# Altium schematic sheet ngh-main.SchDoc
size A4
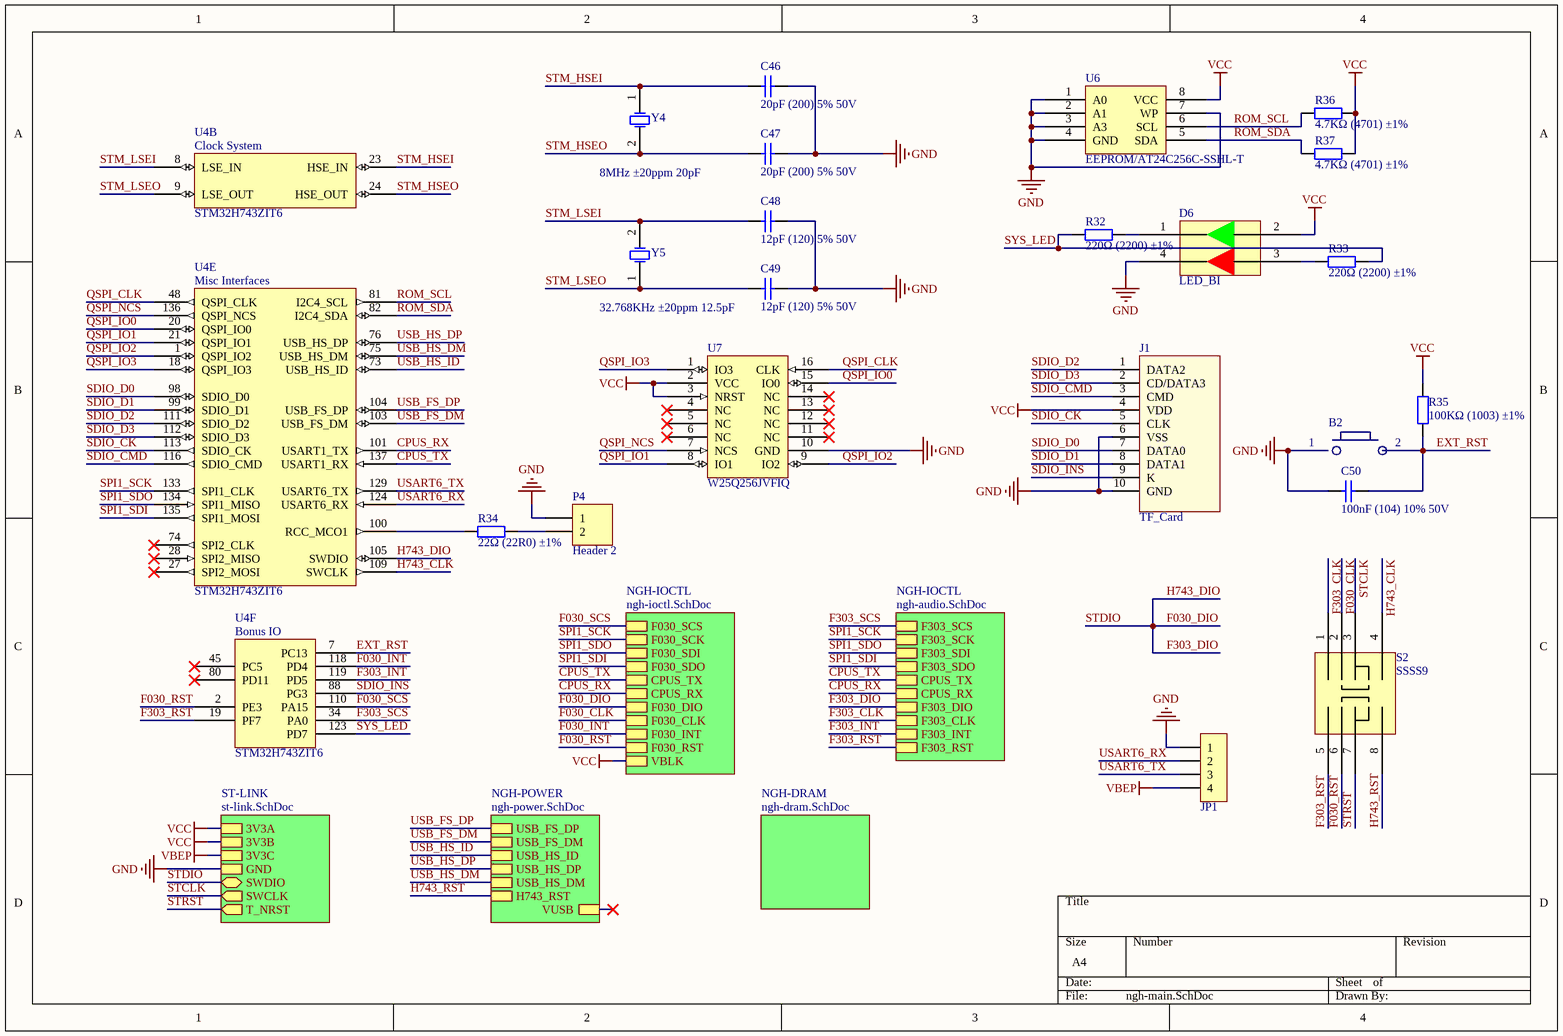
[diagram p0: ngh-main.SchDoc]

## Parts
B2  B1  [MetalButton]  (value not drawn)
C46  20pF (200) 5% 50V  [0603_C]
C47  20pF (200) 5% 50V  [0603_C]
C48  12pF (120) 5% 50V  [0603_C]
C49  12pF (120) 5% 50V  [0603_C]
C50  100nF (104) 10% 50V  [0603_C]
D6  LED_BI  [LED_BI]
J1  TF_Card  [Micro SD]
JP1  HDR-1X4  [HDR2.54-WS-4P]  (value not drawn)
P4  Header 2  [HDR1X2]
R32  220Ω (2200) ±1%  [0603_R]
R33  220Ω (2200) ±1%  [0603_R]
R34  22Ω (22R0) ±1%  [0603_R]
R35  100KΩ (1003) ±1%  [0603_R]
R36  4.7KΩ (4701) ±1%  [0603_R]
R37  4.7KΩ (4701) ±1%  [0603_R]
S2  SSSS9  [SSSS9_5mm_H]
U4  STM32H743ZIT6  [LQFP-144_20x20]  (parts B,E,F of 6)
U6  EEPROM/AT24C256C-SSHL-T  [SOIC-8_150mil]
U7  W25Q256JVFIQ  [SOIC-16_300mil]
Y4  8MHz ±20ppm 20pF  [SMD-5032_2P]
Y5  32.768KHz ±20ppm 12.5pF  [SMD-3215_2P FC - 135]

## Sub-sheets
NGH-DRAM = ngh-dram.SchDoc: no entries
NGH-IOCTL = ngh-ioctl.SchDoc: F030_SCS, F030_SCK, F030_SDI, F030_SDO, CPUS_TX, CPUS_RX, F030_DIO, F030_CLK, F030_INT, F030_RST, VBLK
NGH-IOCTL = ngh-audio.SchDoc: F303_SCS, F303_SCK, F303_SDI, F303_SDO, CPUS_TX, CPUS_RX, F303_DIO, F303_CLK, F303_INT, F303_RST
NGH-POWER = ngh-power.SchDoc: USB_FS_DP, USB_FS_DM, USB_HS_ID, USB_HS_DP, USB_HS_DM, H743_RST, VUSB
ST-LINK = st-link.SchDoc: 3V3A, 3V3B, 3V3C, GND, SWDIO (bidir), SWCLK (out), T_NRST (out)

## Nets
GND: B2.1 C46.2 C47.2 C48.2 C49.2 C50.1 D6.4 J1.6(VSS) J1.10(GND) JP1.1 P4.1 U6.1(A0) U6.2(A1) U6.3(A3) U6.4(GND) U6.7(WP) U7.10(GND) ; sheet ST-LINK/GND
VBEP: JP1.4 ; sheet ST-LINK/3V3C
VCC: D6.2 J1.4(VDD) R35.2 R36.1 R37.1 U6.8(VCC) U7.2(VCC) U7.3(NRST) ; sheet ST-LINK/3V3A, sheet ST-LINK/3V3B, sheet NGH-IOCTL/VBLK
CPUS_RX: U4.101(USART1_TX) ; sheet NGH-IOCTL/CPUS_RX, sheet NGH-IOCTL/CPUS_RX
CPUS_TX: U4.137(USART1_RX) ; sheet NGH-IOCTL/CPUS_TX, sheet NGH-IOCTL/CPUS_TX
EXT_RST: B2.2 C50.2 R35.1 U4.7(PC13)
F030_CLK: S2.2 ; sheet NGH-IOCTL/F030_CLK
F030_DIO: U4.105(SWDIO) ; sheet ST-LINK/SWDIO, sheet NGH-IOCTL/F030_DIO, sheet NGH-IOCTL/F303_DIO  [also labelled F303_DIO, H743_DIO, STDIO]
F030_INT: U4.118(PD4) ; sheet NGH-IOCTL/F030_INT
F030_RST: S2.6 U4.2(PE3) ; sheet NGH-IOCTL/F030_RST
F030_SCS: U4.110(PA15) ; sheet NGH-IOCTL/F030_SCS
F303_CLK: S2.1 ; sheet NGH-IOCTL/F303_CLK
F303_INT: U4.119(PD5) ; sheet NGH-IOCTL/F303_INT
F303_RST: S2.5 U4.19(PF7) ; sheet NGH-IOCTL/F303_RST
F303_SCS: U4.34(PA0) ; sheet NGH-IOCTL/F303_SCS
H743_CLK: S2.4 U4.109(SWCLK)
H743_RST: S2.8 ; sheet NGH-POWER/H743_RST
QSPI_CLK: U4.48(QSPI_CLK) U7.16(CLK)
QSPI_IO0: U4.20(QSPI_IO0) U7.15(IO0)
QSPI_IO1: U4.21(QSPI_IO1) U7.8(IO1)
QSPI_IO2: U4.1(QSPI_IO2) U7.9(IO2)
QSPI_IO3: U4.18(QSPI_IO3) U7.1(IO3)
QSPI_NCS: U4.136(QSPI_NCS) U7.7(NCS)
ROM_SCL: R36.2 U4.81(I2C4_SCL) U6.6(SCL)
ROM_SDA: R37.2 U4.82(I2C4_SDA) U6.5(SDA)
SDIO_CK: J1.5(CLK) U4.113(SDIO_CK)
SDIO_CMD: J1.3(CMD) U4.116(SDIO_CMD)
SDIO_D0: J1.7(DATA0) U4.98(SDIO_D0)
SDIO_D1: J1.8(DATA1) U4.99(SDIO_D1)
SDIO_D2: J1.1(DATA2) U4.111(SDIO_D2)
SDIO_D3: J1.2(CD/DATA3) U4.112(SDIO_D3)
SDIO_INS: J1.9(K) U4.88(PG3)
SPI1_SCK: U4.133(SPI1_CLK) ; sheet NGH-IOCTL/F030_SCK, sheet NGH-IOCTL/F303_SCK
SPI1_SDI: U4.135(SPI1_MOSI) ; sheet NGH-IOCTL/F030_SDO, sheet NGH-IOCTL/F303_SDO
SPI1_SDO: U4.134(SPI1_MISO) ; sheet NGH-IOCTL/F030_SDI, sheet NGH-IOCTL/F303_SDI
STCLK: S2.3 ; sheet ST-LINK/SWCLK
STM_HSEI: C46.1 U4.23(HSE_IN) Y4.1(OSC1)
STM_HSEO: C47.1 U4.24(HSE_OUT) Y4.2(OSC2)
STM_LSEI: C48.1 U4.8(LSE_IN) Y5.2(OSC2)
STM_LSEO: C49.1 U4.9(LSE_OUT) Y5.1(OSC1)
STRST: S2.7 ; sheet ST-LINK/T_NRST
SYS_LED: R32.1 R33.2 U4.123(PD7)
USART6_RX: JP1.2 U4.124(USART6_RX)
USART6_TX: JP1.3 U4.129(USART6_TX)
USB_FS_DM: U4.103(USB_FS_DM) ; sheet NGH-POWER/USB_FS_DM
USB_FS_DP: U4.104(USB_FS_DP) ; sheet NGH-POWER/USB_FS_DP
USB_HS_DM: U4.75(USB_HS_DM) ; sheet NGH-POWER/USB_HS_DM
USB_HS_DP: U4.76(USB_HS_DP) ; sheet NGH-POWER/USB_HS_DP
USB_HS_ID: U4.73(USB_HS_ID) ; sheet NGH-POWER/USB_HS_ID
NetD6_1: D6.1 R32.2
NetD6_3: D6.3 R33.1
NetP4_2: P4.2 R34.2
NetR34_1: R34.1 U4.100(RCC_MCO1)

Not connected (* = marked no-connect by the designer): U4 27(SPI2_MOSI)* 28(SPI2_MISO)* 45(PC5)* 74(SPI2_CLK)* 80(PD11)*; U7 4(NC)* 5(NC)* 6(NC)* 11(NC)* 12(NC)* 13(NC)* 14(NC)*

## Notes on the sheet
- (in symbol STM32H743ZIT6, part B) Clock System
- (in symbol STM32H743ZIT6, part E) Misc Interfaces
- (in symbol STM32H743ZIT6, part F) Bonus IO

## Library data of the parts
B2 = MetalButton
C46 C47 = 0603 20pF (200) 5% 50V: 贴片电容; ComponentLink1Description: 供应商链接; ComponentLink1URL: http://www.szlcsc.com/product/details_2000.html; Package: 0603; Supplier: LC; SuppliersPartNumber: C1648
C48 C49 = 0603 12pF (120) 5% 50V: 贴片电容; ComponentLink1Description: 供应商链接; ComponentLink1URL: http://www.szlcsc.com/product/details_39506.html; Package: 0603; Supplier: LC; SuppliersPartNumber: C38523
C50 = 0603 100nF (104) 10% 50V: 贴片电容; ComponentLink1Description: 供应商链接; ComponentLink1URL: http://www.szlcsc.com/product/details_15331.html; Package: 0603; Supplier: LC; SuppliersPartNumber: C14663
J1 = TF_Card: TF卡座; 版权归属: 源创客; BOM名称: TF卡座; 学习资源: www.ooocke.com
JP1 = Header 4: 4P接插件; 版权归属: 源创客; BOM名称: 4P接插件; 学习资源: www.ooocke.com
P4 = Header 2: Header, 2-Pin; LatestRevisionDate: 17-Jul-2002; LatestRevisionNote: Re-released for DXP Platform.; Publisher: Altium Limited
R32 R33 = 0603 220Ω (2200) 1%: 贴片电阻; ComponentLink1Description: 供应商链接; ComponentLink1URL: http://www.szlcsc.com/product/details_23689.html; Package: 0603; Supplier: LC; SuppliersPartNumber: C22962
R34 = 0603 22Ω (22R0) 1%: 贴片电阻; ComponentLink1Description: 供应商链接; ComponentLink1URL: http://www.szlcsc.com/product/details_24078.html; Package: 0603; Supplier: LC; SuppliersPartNumber: C23345
R35 = 0603 100KΩ (1003) 1%: 贴片电阻; ComponentLink1Description: 供应商链接; ComponentLink1URL: http://www.szlcsc.com/product/details_26546.html; Package: 0603; Supplier: LC; SuppliersPartNumber: C25803
R36 R37 = 0603 4.7KΩ (4701) 1%: 贴片电阻; ComponentLink1Description: 供应商链接; ComponentLink1URL: http://www.szlcsc.com/product/details_23889.html; Package: 0603; Supplier: LC; SuppliersPartNumber: C23162
U6 = EEPROM/AT24C256C-SSHL-T_[C6482]: EEPROM; ComponentLink1Description: 供应商链接; ComponentLink1URL: http://www.szlcsc.com/product/details_6947.html; Package: SOIC-8_150mil; Supplier: LC; SuppliersPartNumber: C6482
Y4 = SMD-5032_2P 8MHz 20ppm 20pF: 贴片晶振; ComponentLink1Description: 供应商链接; ComponentLink1URL: http://www.szlcsc.com/product/details_117214.html; Package: SMD-5032_2P; Supplier: LC; SuppliersPartNumber: C115962
Y5 = SMD-3215_2P 32.768KHz 20ppm 12.5pF: 贴片晶振; ComponentLink1Description: 供应商链接; ComponentLink1URL: http://www.szlcsc.com/product/details_33310.html; Package: SMD-3215_2P; Supplier: LC; SuppliersPartNumber: C32346